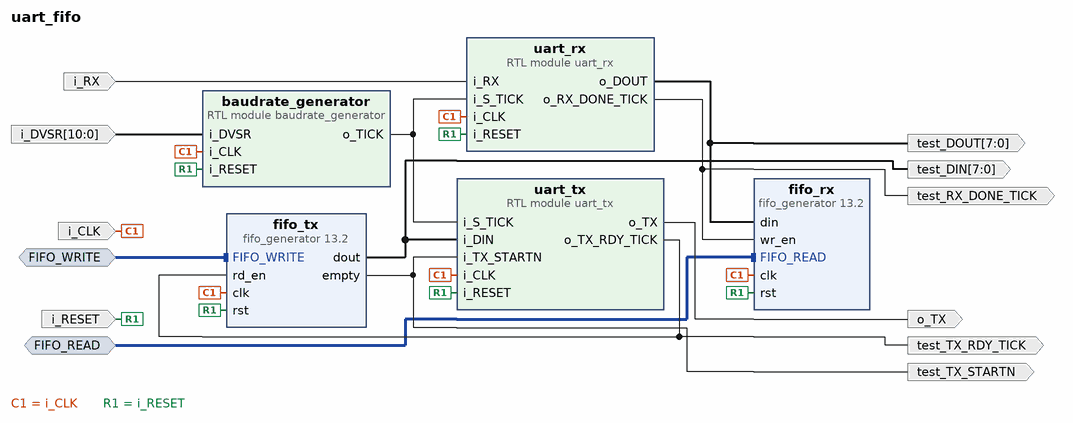
[diagram p0: block diagram of the top level]
# Vivado block design uart_fifo, xc7z020clg400-1, Vivado 2023.2
create_bd_design uart_fifo

create_bd_intf_port -mode Slave -vlnv xilinx.com:interface:fifo_write_rtl:1.0 FIFO_WRITE
create_bd_intf_port -mode Slave -vlnv xilinx.com:interface:fifo_read_rtl:1.0 FIFO_READ
create_bd_port -dir I -type clk i_CLK
create_bd_port -dir I -type rst i_RESET
set_property -dict {CONFIG.POLARITY ACTIVE_HIGH} [get_bd_ports i_RESET]
create_bd_port -dir I -from 10 -to 0 i_DVSR
create_bd_port -dir I i_RX
create_bd_port -dir O o_TX
create_bd_port -dir O -from 7 -to 0 test_DOUT
create_bd_port -dir O test_RX_DONE_TICK
create_bd_port -dir O -from 7 -to 0 test_DIN
create_bd_port -dir O test_TX_STARTN
create_bd_port -dir O test_TX_RDY_TICK

create_bd_cell -type module -reference uart_tx uart_tx
create_bd_cell -type module -reference baudrate_generator baudrate_generator
create_bd_cell -type ip -vlnv xilinx.com:ip:fifo_generator:13.2 fifo_tx
set_property -dict {CONFIG.Fifo_Implementation Common_Clock_Builtin_FIFO CONFIG.Input_Data_Width 8} [get_bd_cells fifo_tx]
create_bd_cell -type module -reference uart_rx uart_rx
create_bd_cell -type ip -vlnv xilinx.com:ip:fifo_generator:13.2 fifo_rx
set_property -dict {CONFIG.Fifo_Implementation Common_Clock_Builtin_FIFO CONFIG.Input_Data_Width 8} [get_bd_cells fifo_rx]

# ---- connections ----

connect_bd_intf_net -intf_net FIFO_READ_0_1 [get_bd_intf_ports FIFO_READ] [get_bd_intf_pins fifo_rx/FIFO_READ]
connect_bd_intf_net -intf_net FIFO_WRITE_0_1 [get_bd_intf_ports FIFO_WRITE] [get_bd_intf_pins fifo_tx/FIFO_WRITE]
connect_bd_net -net baudrate_generator_0_o_TICK [get_bd_pins baudrate_generator/o_TICK] [get_bd_pins uart_rx/i_S_TICK] [get_bd_pins uart_tx/i_S_TICK]
connect_bd_net [get_bd_pins fifo_tx/dout] [get_bd_ports test_DIN] [get_bd_pins uart_tx/i_DIN]
connect_bd_net [get_bd_pins fifo_tx/empty] [get_bd_ports test_TX_STARTN] [get_bd_pins uart_tx/i_TX_STARTN]
connect_bd_net -net i_CLK_0_1 [get_bd_ports i_CLK] \
  [get_bd_pins fifo_tx/clk] [get_bd_pins uart_rx/i_CLK] [get_bd_pins fifo_rx/clk] [get_bd_pins uart_tx/i_CLK] \
  [get_bd_pins baudrate_generator/i_CLK]
connect_bd_net -net i_DVSR_0_1 [get_bd_ports i_DVSR] [get_bd_pins baudrate_generator/i_DVSR]
connect_bd_net -net i_RESET_0_1 [get_bd_ports i_RESET] \
  [get_bd_pins fifo_tx/rst] [get_bd_pins uart_rx/i_RESET] [get_bd_pins fifo_rx/rst] [get_bd_pins uart_tx/i_RESET] \
  [get_bd_pins baudrate_generator/i_RESET]
connect_bd_net -net i_RX_0_1 [get_bd_ports i_RX] [get_bd_pins uart_rx/i_RX]
connect_bd_net [get_bd_pins uart_rx/o_DOUT] [get_bd_ports test_DOUT] [get_bd_pins fifo_rx/din]
connect_bd_net [get_bd_pins uart_rx/o_RX_DONE_TICK] [get_bd_ports test_RX_DONE_TICK] [get_bd_pins fifo_rx/wr_en]
connect_bd_net -net uart_tx_1_o_TX [get_bd_pins uart_tx/o_TX] [get_bd_ports o_TX]
connect_bd_net [get_bd_pins uart_tx/o_TX_RDY_TICK] [get_bd_ports test_TX_RDY_TICK] [get_bd_pins fifo_tx/rd_en]

validate_bd_design
save_bd_design
